# Altium schematic sheet TCS230颜色识别.SchDoc
size A4
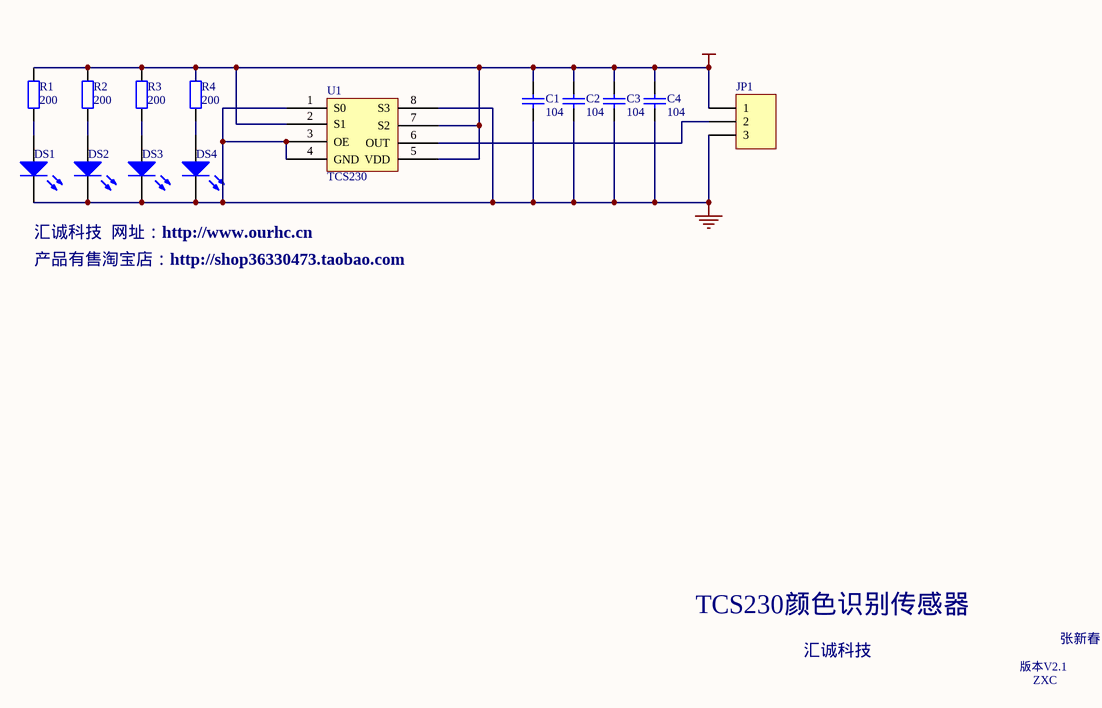
[diagram p0: TCS230颜色识别.SchDoc]

## Parts
C1  value 104  [TP-0805-R]
C2  value 104  [TP-0805-R]
C3  value 104  [TP-0805-R]
C4  value 104  [TP-0805-R]
DS1  LED1  [LED_5]  (value not drawn)
DS2  LED1  [LED_5]  (value not drawn)
DS3  LED1  [LED_5]  (value not drawn)
DS4  LED1  [LED_5]  (value not drawn)
JP1  PZ_3  [HDR-3]  (value not drawn)
R1  value 200  [TP-0805-R]  (hidden comment: Res2)
R2  value 200  [TP-0805-R]  (hidden comment: Res2)
R3  value 200  [TP-0805-R]  (hidden comment: Res2)
R4  value 200  [TP-0805-R]  (hidden comment: Res2)
U1  TCS230  [CDFP-8]

## Nets
GND: C1.1 C2.1 C3.1 C4.1 DS1.2(K) DS2.2(K) DS3.2(K) DS4.2(K) JP1.3 U1.1(S0) U1.3(OE) U1.4(GND) U1.8(S3)
VCC: C1.2 C2.2 C3.2 C4.2 JP1.1 R1.2 R2.2 R3.2 R4.2 U1.2(S1) U1.5(VDD) U1.7(S2)
NetDS1_1: DS1.1(A) R1.1
NetDS2_1: DS2.1(A) R2.1
NetDS3_1: DS3.1(A) R3.1
NetDS4_1: DS4.1(A) R4.1
NetJP1_2: JP1.2 U1.6(OUT)

## Notes on the sheet
- 汇诚科技  网址：http://www.ourhc.cn
- 产品有售淘宝店：http://shop36330473.taobao.com
- TCS230颜色识别传感器
- 汇诚科技
- 版本V2.1
- 张新春
- ZXC

## Library data of the parts
C1-C4 = CPDR: 瓷片电容; Published: 8-Jun-2000; LatestRevisionDate: 17-Jul-2002; LatestRevisionNote: Re-released for DXP Platform.; Publisher: Altium Limited
DS1-DS4 = LED1: Typical RED GaAs LED; Published: 8-Jun-2000; LatestRevisionDate: 17-Jul-2002; LatestRevisionNote: Re-released for DXP Platform.; Publisher: Altium Limited
JP1 = PZ_3: 排针——3; LatestRevisionDate: 17-Jul-2002; LatestRevisionNote: Re-released for DXP Platform.; Publisher: Altium Limited
R1-R4 = Res2: Resistor; Published: 8-Jun-2000; LatestRevisionDate: 17-Jul-2002; LatestRevisionNote: Re-released for DXP Platform.; Publisher: Altium Limited
U1 = TCS230: 颜色识别传感器